# Altium project Control_Board.PrjPcb
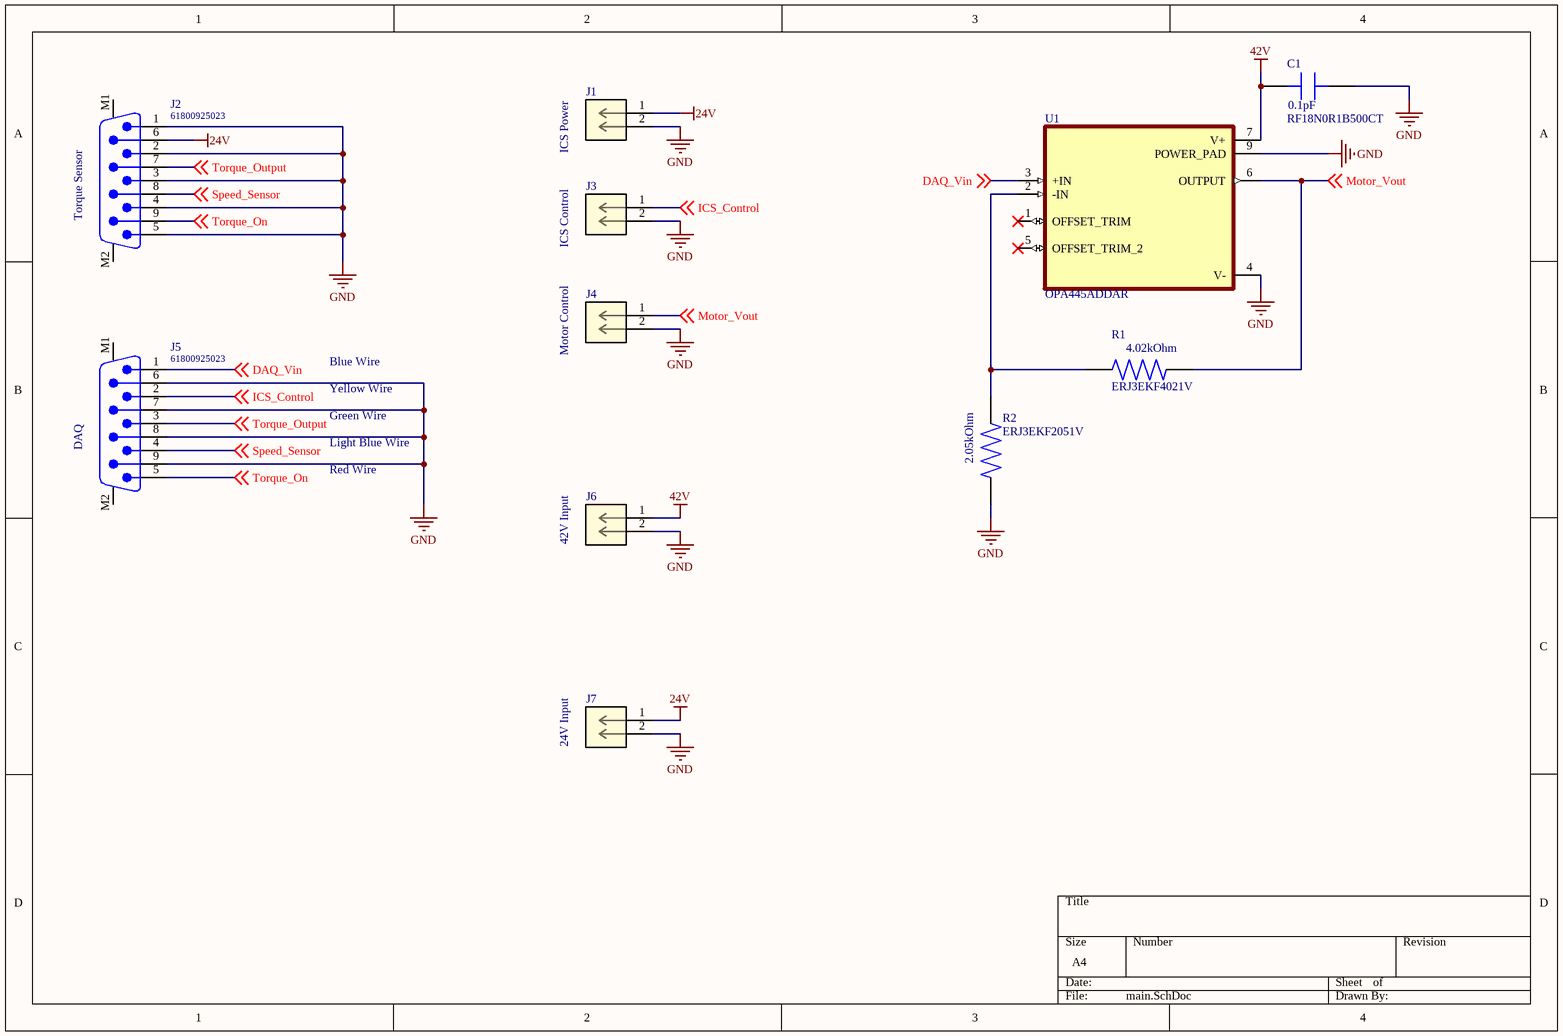
[diagram p0: main.SchDoc]
1 sheet, 11 parts. Net scope: global (net labels, ports and power ports of the same name join across sheets).
Board file: Control_Board.PcbDoc

## Sheet main.SchDoc
size A4; SheetNumber: 1; SheetTotal: 1

### Parts
C1  RF18N0R1B500CT  [0603]
J1  https://www.digikey.ca/en/products/detail/molex/0731375003/1465136  [CONN_73137-5003_MOL]  (value not drawn)
J2  61800925023  [61800925023]
J3  https://www.digikey.ca/en/products/detail/molex/0731375003/1465136  [CONN_73137-5003_MOL]  (value not drawn)
J4  https://www.digikey.ca/en/products/detail/molex/0731375003/1465136  [CONN_73137-5003_MOL]  (value not drawn)
J5  61800925023  [61800925023]
J6  https://www.digikey.ca/en/products/detail/molex/0731375003/1465136  [CONN_73137-5003_MOL]  (value not drawn)
J7  https://www.digikey.ca/en/products/detail/molex/0731375003/1465136  [CONN_73137-5003_MOL]  (value not drawn)
R1  ERJ3EKF4021V  [0603]
R2  ERJ3EKF2051V  [0603]
U1  OPA445ADDAR  [VREG_LM5017MR/NOPB]

### Nets
24V: J1.1 J2.6 J7.1
42V: C1.1 J6.1 U1.7(V+)
GND: C1.2 J1.2 J2.1 J2.2 J2.3 J2.4 J2.5 J3.2 J4.2 J5.6 J5.7 J5.8 J5.9 J6.2 J7.2 R2.1 U1.4(V-) U1.9(POWER_PAD)
DAQ_Vin: J5.1 U1.3(+IN) ; off-sheet DAQ_Vin
ICS_Control: J3.1 J5.2 ; off-sheet ICS_Control
Motor_Vout: J4.1 R1.2 U1.6(OUTPUT) ; off-sheet Motor_Vout
Speed_Sensor: J2.8 J5.4 ; off-sheet Speed_Sensor
Torque_On: J2.9 J5.5 ; off-sheet Torque_On
Torque_Output: J2.7 J5.3 ; off-sheet Torque_Output
NetR1_1: R1.1 R2.2 U1.2(-IN)

Not connected (* = marked no-connect by the designer): J2 M1 M2; J5 M1 M2; U1 1(OFFSET_TRIM)* 5(OFFSET_TRIM_2)*

### Notes on the sheet
- ICS Power
- (near J2) Torque Sensor
- ICS Control
- Blue Wire
- Motor Control
- (near J5) DAQ
- Yellow Wire
- Green Wire
- Light Blue Wire
- Red Wire
- 42V Input
- 24V Input
- (in symbol ERJ3EKF2051V) 2.05kOhm
- (in symbol ERJ3EKF4021V) 4.02kOhm
- (in symbol RF18N0R1B500CT) 0.1pF

### Library data of the parts
J1 J3 J4 J6 J7 = 731375003: Mfr_Name: Molex Connector Corporation; Copyright: Copyright (C) 2022 Ultra Librarian. All rights reserved.; Manufacturer_Part_Number: 731375003; RefDes: RefDes; Type: DEV
J2 J5 = CMP-1502-00276-1: Male PCB Connector WR-DSUB, Vertical, 9 pins; Manufacturer: Wurth Elektronik; Rated Current: 3A; Working Voltage: 125VAC; Pin Number: 9; Contact Resistance: 30mOhm; Part Number: 61800925023; Gender: Male; Datasheet URL: https://katalog.we-online.de/em/datasheet/6180xx25023.pdf; Manufacturer URL: http://www.we-online.de; Package Reference: 61800925023; Mounting Technology: THT; Operating Temperature: -40to85degC; Orientation: Vertical; Packaging: Tray; Publisher: WurthElektronik
U1 = OPA445ADDAR: Package: None; Price: None; Value: *; MP: OPA445ADDAR; Availability: Unavailable